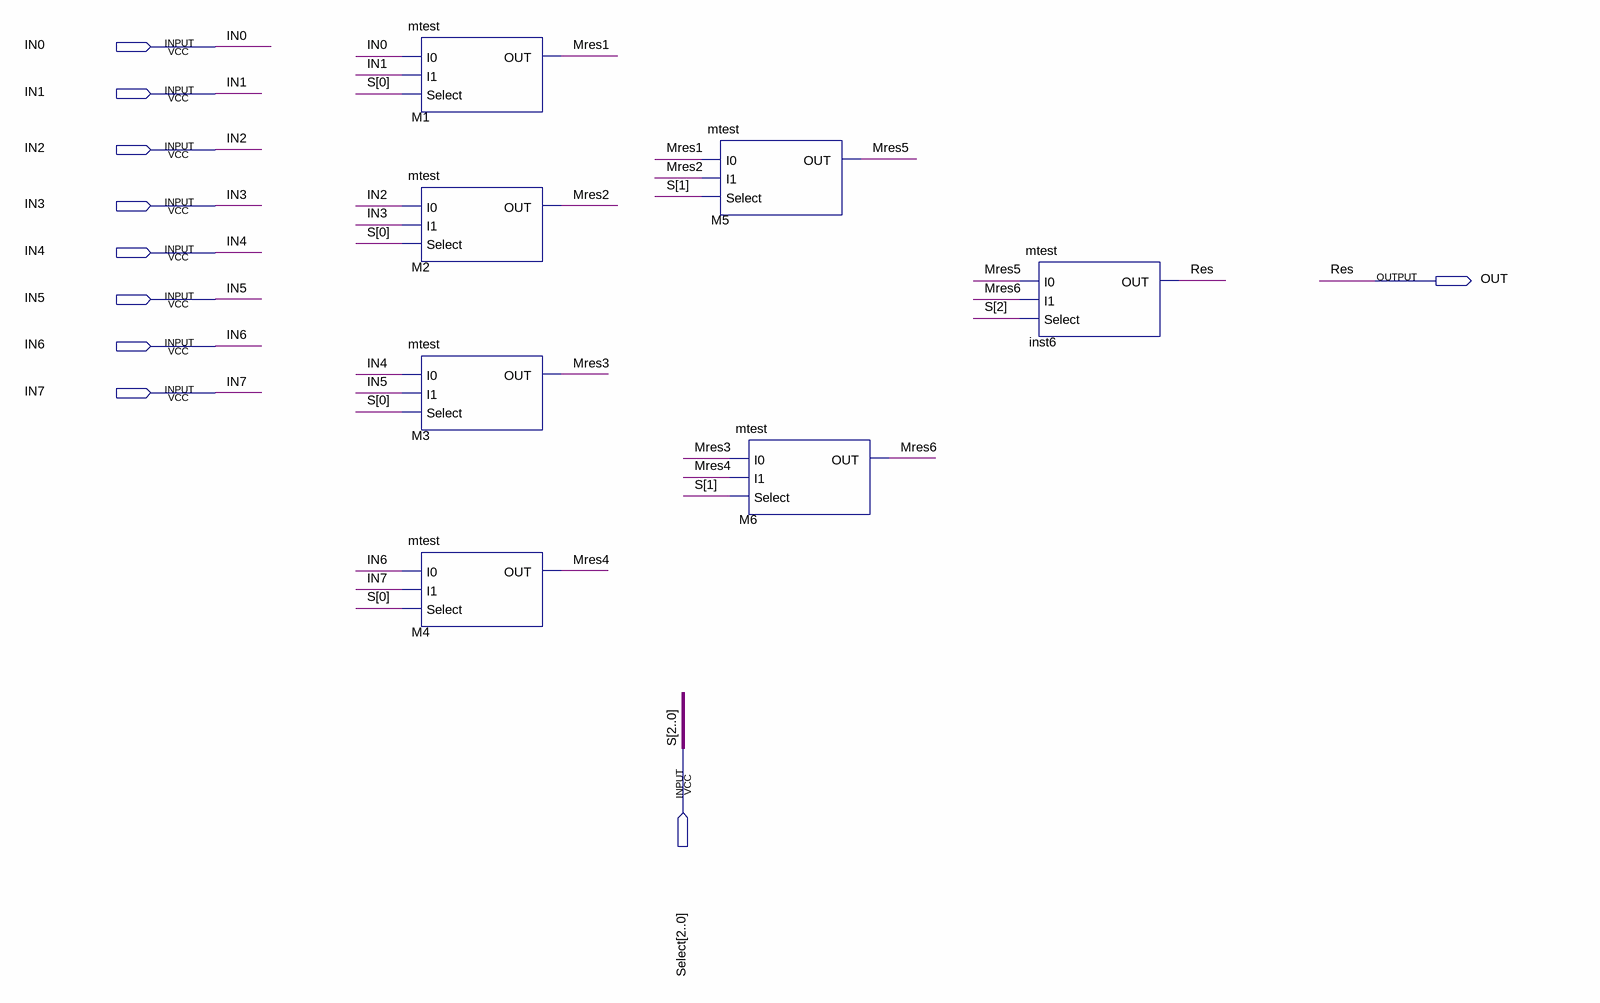
[diagram p0: schematic sheet]
// Quartus schematic my81MUX.bdf as structural Verilog: 7 symbols, 10 pins
module my81MUX (
  input  IN0,
  input  IN1,
  input  IN2,
  input  IN3,
  input  IN4,
  input  IN5,
  input  IN6,
  input  IN7,
  input  [2:0] Select,
  output OUT
);

  wire Mres1, Mres2, Mres3, Mres4, Mres5, Mres6;

  mtest M1 (.I0(IN0), .I1(IN1), .Select(Select[0]), .OUT(Mres1));
  mtest M2 (.I0(IN2), .I1(IN3), .Select(Select[0]), .OUT(Mres2));
  mtest M3 (.I0(IN4), .I1(IN5), .Select(Select[0]), .OUT(Mres3));
  mtest M4 (.I0(IN6), .I1(IN7), .Select(Select[0]), .OUT(Mres4));
  mtest M5 (.I0(Mres1), .I1(Mres2), .Select(Select[1]), .OUT(Mres5));
  mtest M6 (.I0(Mres3), .I1(Mres4), .Select(Select[1]), .OUT(Mres6));
  mtest inst6 (.I0(Mres5), .I1(Mres6), .Select(Select[2]), .OUT(OUT));

  // Other names for the same wires on the sheet: Res = OUT; S[2:0] = Select
endmodule
